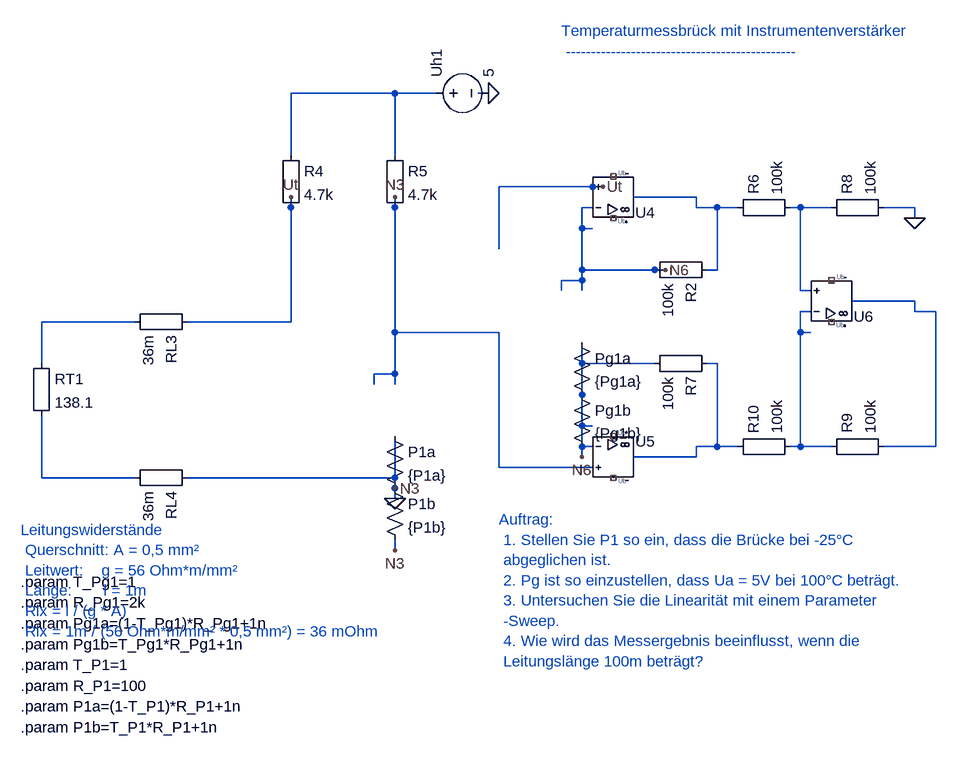
[diagram p0: schematic 1_4_3_PT100-Sensor_Bruecke_Instrumentenverstärker.asc]
1_4_3_PT100-Sensor_Bruecke_Instrumentenverstärker.asc, the LTspice schematic file:
Version 4
SHEET 1 880 680
WIRE 944 336 928 336
WIRE 928 336 928 368
WIRE 928 368 944 368
WIRE 1008 320 1104 320
WIRE 1104 320 1104 336
WIRE 784 160 768 160
WIRE 944 704 928 704
WIRE 928 704 928 672
WIRE 928 672 944 672
WIRE 1008 720 1104 720
WIRE 1104 720 1104 704
WIRE 1280 496 1264 496
WIRE 1264 496 1264 528
WIRE 1264 528 1280 528
WIRE 1344 480 1440 480
WIRE 1440 480 1440 496
WIRE 96 656 96 752
WIRE 96 752 240 752
WIRE 240 512 96 512
WIRE 96 512 96 576
WIRE 704 160 640 160
WIRE 640 160 480 160
WIRE 480 160 480 256
WIRE 640 256 640 160
WIRE 640 784 640 752
WIRE 640 336 640 528
WIRE 640 608 640 592
WIRE 608 608 608 592
WIRE 608 592 640 592
WIRE 640 752 320 752
WIRE 640 688 640 752
WIRE 1104 336 1136 336
WIRE 1120 432 1136 432
WIRE 1136 432 1136 336
WIRE 928 368 928 432
WIRE 640 528 640 592
WIRE 944 736 800 736
WIRE 800 736 800 528
WIRE 800 528 640 528
WIRE 480 336 480 400
WIRE 944 304 800 304
WIRE 800 304 800 400
WIRE 1280 464 1264 464
WIRE 1264 464 1264 336
WIRE 1264 336 1248 336
WIRE 1440 352 1440 336
WIRE 1440 336 1392 336
WIRE 928 432 1040 432
WIRE 928 464 928 448
WIRE 928 448 928 432
WIRE 896 464 896 448
WIRE 896 448 928 448
WIRE 1312 336 1264 336
WIRE 1248 704 1264 704
WIRE 1104 704 1136 704
WIRE 1120 576 1136 576
WIRE 1136 576 1136 704
WIRE 1264 704 1264 528
WIRE 1312 704 1264 704
WIRE 1392 704 1472 704
WIRE 1472 704 1472 496
WIRE 1472 496 1440 496
WIRE 1136 704 1168 704
WIRE 1136 336 1168 336
WIRE 928 544 928 576
WIRE 928 576 928 672
WIRE 1040 576 928 576
WIRE 480 400 480 512
WIRE 480 512 320 512
WIRE 480 336 480 320
WIRE 944 304 960 304
WIRE 640 336 640 320
WIRE 640 848 640 864
WIRE 928 704 928 720
WIRE 1040 432 1056 432
FLAG 784 160 0
FLAG 640 784 0
FLAG 1440 352 0
FLAG 640 784 0
FLAG 784 160 0
FLAG 1440 352 0
FLAG 480 320 Ut
FLAG 960 304 Ut
FLAG 640 320 N3
FLAG 640 864 N3
FLAG 640 768 N3
FLAG 928 720 N6
FLAG 1056 432 N6
SYMBOL UniversalOpAmp2 976 320 M180
SYMATTR InstName U4
SYMATTR Value UniversalOpAmp2
SYMBOL Misc\EuropeanResistor 80 560 R0
SYMATTR InstName RT1
SYMATTR Value 138.1
SYMBOL Misc\EuropeanResistor 336 496 R90
SYMATTR InstName RL3
SYMATTR Value 36m
SYMBOL Misc\EuropeanResistor 336 736 R90
SYMATTR InstName RL4
SYMATTR Value 36m
SYMBOL Misc\EuropeanResistor 1136 416 R90
SYMATTR InstName R2
SYMATTR Value 100k
SYMBOL voltage 688 160 R270
SYMATTR InstName Uh1
SYMATTR Value 5
SYMBOL Misc\EuropeanResistor 464 240 R0
SYMATTR InstName R4
SYMATTR Value 4.7k
SYMBOL Misc\EuropeanResistor 624 240 R0
SYMATTR InstName R5
SYMATTR Value 4.7k
SYMBOL Misc\EuropeanResistor 1152 352 R270
SYMATTR InstName R6
SYMATTR Value 100k
SYMBOL Misc\EuropeanResistor 1136 560 R90
SYMATTR InstName R7
SYMATTR Value 100k
SYMBOL UniversalOpAmp2 976 720 R0
SYMATTR InstName U5
SYMATTR Value UniversalOpAmp2
SYMBOL res 912 528 R0
SYMATTR InstName Pg1a
SYMATTR Value {Pg1a}
SYMBOL res 912 608 R0
SYMATTR InstName Pg1b
SYMATTR Value {Pg1b}
SYMBOL res 624 672 R0
SYMATTR InstName P1a
SYMATTR Value {P1a}
SYMBOL res 624 752 R0
SYMATTR InstName P1b
SYMATTR Value {P1b}
SYMBOL UniversalOpAmp2 1312 480 M180
SYMATTR InstName U6
SYMATTR Value UniversalOpAmp2
SYMBOL Misc\EuropeanResistor 1296 352 R270
SYMATTR InstName R8
SYMATTR Value 100k
SYMBOL Misc\EuropeanResistor 1296 720 R270
SYMATTR InstName R9
SYMATTR Value 100k
SYMBOL Misc\EuropeanResistor 1152 720 R270
SYMATTR InstName R10
SYMATTR Value 100k
TEXT 64 912 Left 2 !.param T_Pg1=1
TEXT 64 944 Left 2 !.param R_Pg1=2k
TEXT 64 976 Left 2 !.param Pg1a=(1-T_Pg1)*R_Pg1+1n
TEXT 64 1008 Left 2 !.param Pg1b=T_Pg1*R_Pg1+1n
TEXT 64 1040 Left 2 !.param T_P1=1
TEXT 64 1072 Left 2 !.param R_P1=100
TEXT 64 1104 Left 2 !.param P1a=(1-T_P1)*R_P1+1n
TEXT 64 1136 Left 2 !.param P1b=T_P1*R_P1+1n
TEXT 64 832 Left 2 ;Leitungswiderstände \n Querschnitt: A = 0,5 mm² \n Leitwert:    g = 56 Ohm*m/mm² \n Länge:       l = 1m \n Rlx = l / (g * A) \n Rlx = 1m / (56 Ohm*m/mm² * 0,5 mm²) = 36 mOhm
TEXT 800 816 Left 2 ;Auftrag: \n 1. Stellen Sie P1 so ein, dass die Brücke bei -25°C \n abgeglichen ist. \n 2. Pg ist so einzustellen, dass Ua = 5V bei 100°C beträgt. \n 3. Untersuchen Sie die Linearität mit einem Parameter \n -Sweep. \n 4. Wie wird das Messergebnis beeinflusst, wenn die \n Leitungslänge 100m beträgt?
TEXT 896 64 Left 2 ;Temperaturmessbrück mit Instrumentenverstärker \n ----------------------------------------------

The netlist it stands for:
* 1_4_3_PT100-Sensor_Bruecke_Instrumentenverstärker.asc
XU4 Ut N6 NC_01 NC_02 N001 level2 UniversalOpAmp2 Avol=1Meg GBW=10Meg Slew=10Meg Ilimit=25m Rail=0 Vos=0 En=0 Enk=0 In=0 Ink=0 Rin=500Meg  ; pins In+ In- V+ V- OUT
RT1 N006 N005 138.1
RL3 Ut N006 36m
RL4 0 N005 36m
R2 N001 N6 100k
V§Uh1 N007 0 5
R4 N007 Ut 4.7k
R5 N007 0 4.7k
R6 N001 N008 100k
R7 N002 N6 100k
XU5 0 N6 NC_03 NC_04 N002 level2 UniversalOpAmp2 Avol=1Meg GBW=10Meg Slew=10Meg Ilimit=25m Rail=0 Vos=0 En=0 Enk=0 In=0 Ink=0 Rin=500Meg  ; pins In+ In- V+ V- OUT
R§Pg1a N6 N6 {Pg1a}
R§Pg1b N6 N6 {Pg1b}
R§P1a 0 0 {P1a}
R§P1b 0 0 {P1b}
XU6 N008 N003 NC_05 NC_06 N004 level2 UniversalOpAmp2 Avol=1Meg GBW=10Meg Slew=10Meg Ilimit=25m Rail=0 Vos=0 En=0 Enk=0 In=0 Ink=0 Rin=500Meg  ; pins In+ In- V+ V- OUT
R8 N008 0 100k
R9 N003 N004 100k
R10 N002 N003 100k
.param T_Pg1=1
.param R_Pg1=2k
.param Pg1a=(1-T_Pg1)*R_Pg1+1n
.param Pg1b=T_Pg1*R_Pg1+1n
.param T_P1=1
.param R_P1=100
.param P1a=(1-T_P1)*R_P1+1n
.param P1b=T_P1*R_P1+1n
* Leitungswiderstände
*  Querschnitt: A = 0,5 mm²
*  Leitwert:    g = 56 Ohm*m/mm²
*  Länge:       l = 1m
*  Rlx = l / (g * A)
*  Rlx = 1m / (56 Ohm*m/mm² * 0,5 mm²) = 36 mOhm
* Auftrag:
*  1. Stellen Sie P1 so ein, dass die Brücke bei -25°C
*  abgeglichen ist.
*  2. Pg ist so einzustellen, dass Ua = 5V bei 100°C beträgt.
*  3. Untersuchen Sie die Linearität mit einem Parameter
*  -Sweep.
*  4. Wie wird das Messergebnis beeinflusst, wenn die
*  Leitungslänge 100m beträgt?
* Temperaturmessbrück mit Instrumentenverstärker
*  ----------------------------------------------
.lib UniversalOpAmp2.lib
.backanno
.end